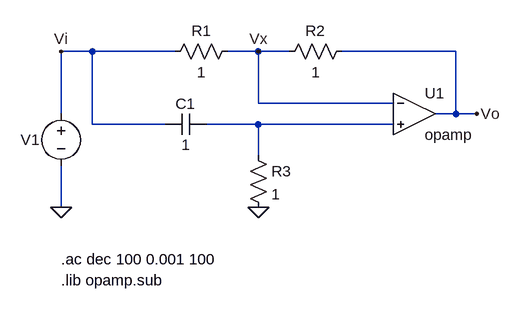
[diagram p0: schematic pasatodo_normalizado.asc]
pasatodo_normalizado.asc, the LTspice schematic file:
Version 4
SHEET 1 1200 800
WIRE 224 256 176 256
WIRE 352 256 224 256
WIRE 480 256 432 256
WIRE 528 256 480 256
WIRE 784 256 608 256
WIRE 480 336 480 256
WIRE 688 336 480 336
WIRE 176 352 176 256
WIRE 784 352 784 256
WIRE 784 352 752 352
WIRE 816 352 784 352
WIRE 224 368 224 256
WIRE 336 368 224 368
WIRE 480 368 400 368
WIRE 688 368 480 368
WIRE 480 416 480 368
WIRE 176 496 176 432
FLAG 176 496 0
FLAG 480 496 0
FLAG 176 256 Vi
FLAG 816 352 Vo
FLAG 480 256 Vx
SYMBOL voltage 176 336 R0
WINDOW 3 24 96 Invisible 2
WINDOW 0 -62 56 Left 2
SYMATTR Value ""
SYMATTR InstName V1
SYMATTR Value2 AC 1 0
SYMBOL res 448 240 R90
WINDOW 0 0 56 VBottom 2
WINDOW 3 32 56 VTop 2
SYMATTR InstName R1
SYMATTR Value 1
SYMBOL cap 400 352 R90
WINDOW 0 0 32 VBottom 2
WINDOW 3 32 32 VTop 2
SYMATTR InstName C1
SYMATTR Value 1
SYMBOL res 464 400 R0
SYMATTR InstName R3
SYMATTR Value 1
SYMBOL res 624 240 R90
WINDOW 0 0 56 VBottom 2
WINDOW 3 32 56 VTop 2
SYMATTR InstName R2
SYMATTR Value 1
SYMBOL OpAmps/opamp 720 288 R0
SYMATTR InstName U1
TEXT 176 576 Left 2 !.ac dec 100 0.001 100
TEXT 176 608 Left 2 !.lib opamp.sub

The netlist it stands for:
* pasatodo_normalizado.asc
V1 Vi 0 AC 1 0
R1 Vx Vi 1
C1 N001 Vi 1
R3 N001 0 1
R2 Vo Vx 1
XU1 Vx N001 Vo opamp Aol=100K GBW=10Meg  ; pins invin noninvin out
.ac dec 100 0.001 100
.lib opamp.sub
.backanno
.end